# EAGLE design klone-board2 (EAGLE 7.3.0)
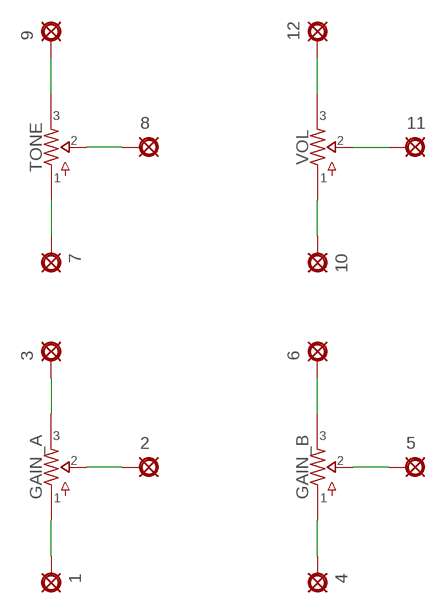
[diagram p0: schematic, sheet 1]

## Parts
1  PAD  [SQUARE]
2  PAD  [SQUARE]
3  PAD  [SQUARE]
4  PAD  [SQUARE]
5  PAD  [SQUARE]
6  PAD  [SQUARE]
7  PAD  [SQUARE]
8  PAD  [SQUARE]
9  PAD  [SQUARE]
10  PAD  [SQUARE]
11  PAD  [SQUARE]
12  PAD  [SQUARE]
GAIN  DUALGANG  [9MM_DUALGANG]
TONE  POTS9MM_MOUNTED_2MMH  [9MM_W/MOUNTS-2MMHOLES]
VOL  POTS9MM_MOUNTED_2MMH  [9MM_W/MOUNTS-2MMHOLES]

## Nets
N$1: 9.1(PAD) TONE.P$3
N$2: 8.1(PAD) TONE.P$2
N$3: 7.1(PAD) TONE.P$1
N$4: 3.1(PAD) GAIN.3
N$5: 2.1(PAD) GAIN.2
N$6: 1.1(PAD) GAIN.1
N$7: 4.1(PAD) GAIN.4
N$8: 5.1(PAD) GAIN.5
N$9: 6.1(PAD) GAIN.6
N$10: 10.1(PAD) VOL.P$1
N$11: 11.1(PAD) VOL.P$2
N$12: 12.1(PAD) VOL.P$3

## Library data of the parts
1-12 = kdd-supply:PAD: PAD use this package for pads with any purpose, including input, output, send or return various pad shapes: round, square, octogonal, long, and long offset
GAIN = kdd-mb-pots:DUALGANG
TONE VOL = kdd-mb-pots:POTS

## Board
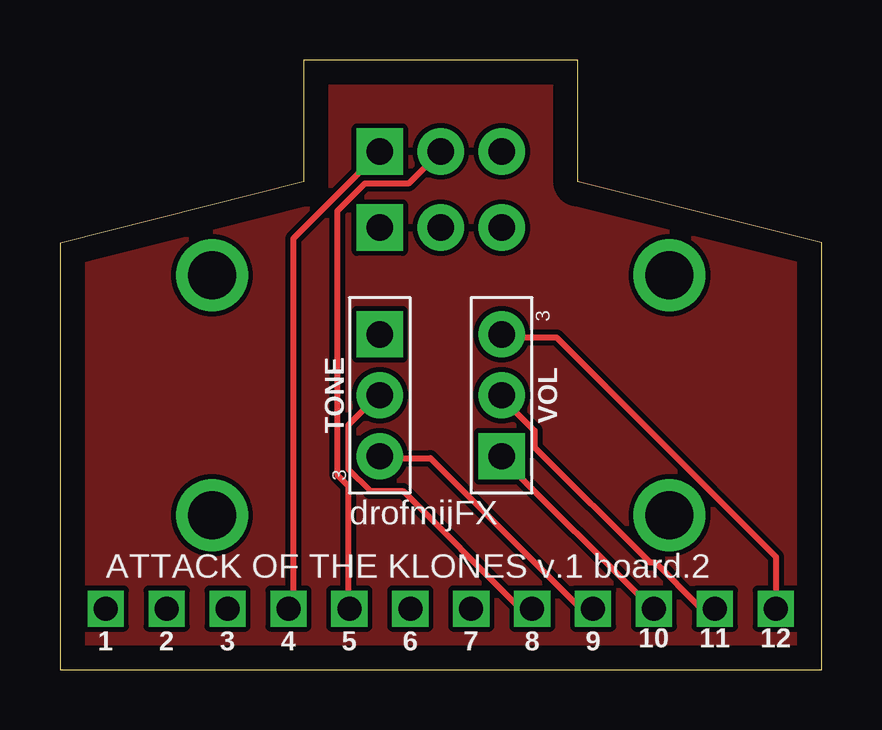
[diagram p1: board, top side]
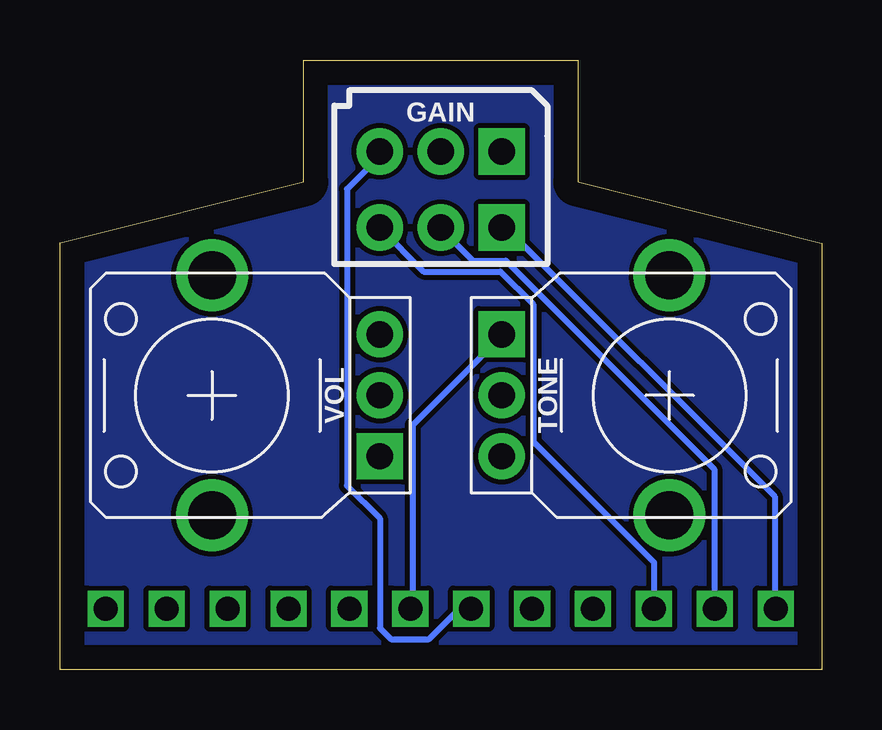
[diagram p2: board, bottom side, seen from below]

Size 31.75 x 25.4 mm. Coordinates in mm from the lower left corner, seen from the top.
Outline: 0,0 31.75,0 31.75,17.78 21.59,20.32 21.59,25.4 10.16,25.4 10.16,20.32 0,17.77 0,0
Copper layers (1*16): Top 0.035mm / dielectric 1.5mm / Bottom 0.035mm
Design rules "default": minimum track width 10mil, minimum drill 24mil, track to track 8mil, track to pad 8mil, pad to pad 8mil, via to via 8mil, smd to smd 8mil, copper to edge 40mil, drill to drill 8mil, minimum pad ring 10mil, minimum via ring 8mil, stop-mask expansion 4mil, vias tented up to drill 0mil, thermal gap 10mil

### Footprints (pad centres in the part's own frame; a part is rotated, then mirrored left to right if it is on the bottom)
SQUARE = drill 1 square: 1 0,0
9MM_DUALGANG = drill 1.1 pad 1.93 square: 1 2.54,0; 4 2.54,3.175 | drill 1.1 pad 1.93: 2 0,0; 3 -2.54,0; 5 0,3.175; 6 -2.54,3.175
9MM_W/MOUNTS-2MMHOLES = drill 1.1 pad 1.93 square: P$1 2.54,0 | drill 1.1 pad 1.93: P$2 0,0; P$3 -2.54,0 | drill 2: P$4 -5,7; P$5 5,7

### Placement (x,y rotation side)
1  1.91,2.54 180 top
2  4.45,2.54 180 top
3  6.98,2.54 180 top
4  9.53,2.54 180 top
5  12.06,2.54 180 top
6  14.61,2.54 180 top
7  17.14,2.54 180 top
8  19.68,2.54 180 top
9  22.22,2.54 180 top
10  24.77,2.54 0 top
11  27.3,2.54 0 top
12  29.84,2.54 0 top
GAIN  15.88,18.41 0 bottom
TONE  13.33,11.43 90 top
VOL  18.41,11.43 270 top

### Tracks (layer width: path | path; a pad name or v marks a point on that pad's centre or on a via)
10
  pour Bottom: 0,0 0,17.78 10.16,20.32 10.16,25.4 21.59,25.4 21.59,20.32 31.75,17.78 31.75,0
  pour Top: 0,17.78 10.16,20.32 10.16,25.4 21.59,25.4 21.59,20.32 31.75,17.78 31.75,0 0,0
N$1
  Top 0.254: 9.1 22.07,2.64 21.61,2.64 15.44,8.81 13.39,8.81 TONE.P$3
N$2
  Top 0.254: 8.1 19.56,2.64 19.1,2.64 14.3,7.44 12.93,7.44 12.01,8.36 12.01,10.18 13.16,11.33 TONE.P$2
N$3
  Bottom 0.254: 7.1 17.04,2.64 17.04,10.18 13.39,13.84 TONE.P$1
N$4
  Bottom 0.254: 3.1 6.98,4.47 12.01,9.5 12.01,15.21 13.39,16.59 16.59,16.59 GAIN.3
N$5
  Bottom 0.254: 2.1 4.47,2.64 4.47,8.36 13.16,17.04 14.53,17.04 15.9,18.41 GAIN.2
N$6
  Bottom 0.254: 1.1 1.96,2.64 1.96,7.21 13.16,18.41 GAIN.1
N$7
  Top 0.254: 4.1 9.73,2.64 9.73,17.96 13.16,21.39 GAIN.4
N$8
  Top 0.254: GAIN.5 14.53,20.24 12.7,20.24 11.56,19.1 11.56,8.13 12.01,7.67 12.01,2.64 5.1
N$9
  Bottom 0.254: 6.1 14.76,2.41 15.21,2.41 16.36,1.27 17.96,1.27 18.41,1.73 18.41,6.3 19.79,7.67 19.79,20.02 18.41,21.39 GAIN.6
N$10
  Top 0.254: 10.1 24.59,2.64 18.41,8.81 VOL.P$1
N$11
  Top 0.254: 11.1 27.1,2.64 26.64,2.64 24.82,4.47 24.59,4.47 19.79,9.27 19.79,9.96 18.41,11.33 VOL.P$2
N$12
  Top 0.254: 12.1 29.84,4.7 20.7,13.84 18.41,13.84 VOL.P$3

### Text on the board
tNames: drofmijFX | ATTACK OF THE KLONES v.1 board.2